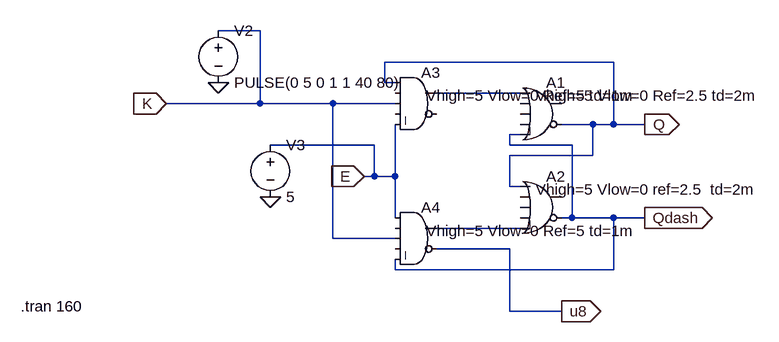
[diagram p0: schematic srlatch.asc]
srlatch.asc, the LTspice schematic file:
Version 4
SHEET 1 880 680
WIRE -240 -64 -304 -64
WIRE 304 -16 -48 -16
WIRE -48 16 -48 -16
WIRE -32 16 -48 16
WIRE 160 32 32 32
WIRE -240 48 -240 -64
WIRE -240 48 -384 48
WIRE -128 48 -240 48
WIRE -32 48 -128 48
WIRE 272 80 224 80
WIRE 304 80 304 -16
WIRE 304 80 272 80
WIRE 352 80 304 80
WIRE 160 96 144 96
WIRE -64 112 -224 112
WIRE 144 112 144 96
WIRE 240 112 144 112
WIRE 272 128 272 80
WIRE 272 128 144 128
WIRE -64 160 -64 112
WIRE -64 160 -80 160
WIRE -32 160 -32 80
WIRE -32 160 -64 160
WIRE 144 176 144 128
WIRE 160 176 144 176
WIRE -32 224 -32 160
WIRE 240 224 240 112
WIRE 240 224 224 224
WIRE 304 224 240 224
WIRE 352 224 304 224
WIRE 160 240 32 240
WIRE -128 256 -128 48
WIRE -32 256 -128 256
WIRE 144 272 32 272
WIRE -32 304 -32 288
WIRE 304 304 304 224
WIRE 304 304 -32 304
WIRE 144 368 144 272
WIRE 224 368 144 368
FLAG 352 80 Q
IOPIN 352 80 Out
FLAG 352 224 Qdash
IOPIN 352 224 Out
FLAG -80 160 E
IOPIN -80 160 In
FLAG -224 192 0
FLAG -304 16 0
FLAG -384 48 K
IOPIN -384 48 In
FLAG 224 368 u8
IOPIN 224 368 Out
SYMBOL Digital\\or 192 0 R0
WINDOW 3 -8 36 Left 2
SYMATTR InstName A1
SYMATTR Value Vhigh=5 Vlow=0 Ref=2.5 td=2m
SYMBOL Digital\\or 192 144 R0
WINDOW 3 -8 36 Left 2
SYMATTR InstName A2
SYMATTR Value Vhigh=5 Vlow=0 ref=2.5  td=2m
SYMBOL voltage -224 96 R0
WINDOW 123 0 0 Left 0
WINDOW 39 0 0 Left 0
SYMATTR InstName V3
SYMATTR Value 5
SYMBOL Digital\\and 0 -16 R0
WINDOW 3 16 52 Left 2
SYMATTR InstName A3
SYMATTR Value Vhigh=5 Vlow=0 Ref=5 td=1m
SYMBOL Digital\\and 0 192 R0
WINDOW 3 16 52 Left 2
SYMATTR InstName A4
SYMATTR Value Vhigh=5 Vlow=0 Ref=5 td=1m
SYMBOL voltage -304 -80 R0
WINDOW 123 0 0 Left 0
WINDOW 39 0 0 Left 0
SYMATTR InstName V2
SYMATTR Value PULSE(0 5 0 1 1 40 80)
TEXT -608 360 Left 2 !.tran 160

The netlist it stands for:
* srlatch.asc
A1 N001 0 0 0 Qdash Q 0 0 OR Vhigh=5 Vlow=0 Ref=2.5 td=2m
A2 Q 0 0 0 N002 Qdash 0 0 OR Vhigh=5 Vlow=0 ref=2.5  td=2m
V3 E 0 5
A3 Q 0 K 0 E 0 N001 0 AND Vhigh=5 Vlow=0 Ref=5 td=1m
A4 E 0 K 0 Qdash u8 N002 0 AND Vhigh=5 Vlow=0 Ref=5 td=1m
V2 K 0 PULSE(0 5 0 1 1 40 80)
.tran 160
.backanno
.end